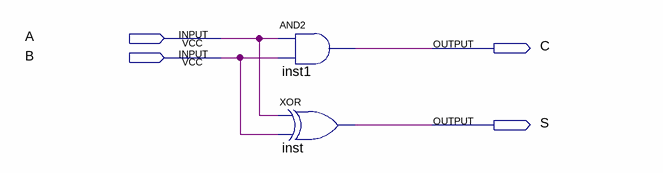
[diagram p0: schematic sheet]
// Quartus schematic banjiaqi.bdf as structural Verilog: 2 symbols, 4 pins
module banjiaqi (
  input  A,
  input  B,
  output C,
  output S
);

  and inst1 (C, A, B);
  xor inst (S, A, B);
endmodule
